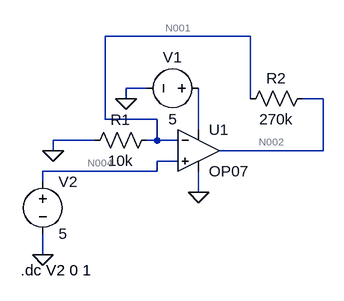
[diagram p0: schematic Draft1.asc]
Draft1.asc, the LTspice schematic file:
Version 4
SHEET 1 880 680
WIRE 256 -16 32 -16
WIRE 96 64 64 64
WIRE 64 80 64 64
WIRE 256 80 256 -16
WIRE 368 80 336 80
WIRE 32 112 32 -16
WIRE 112 112 32 112
WIRE 176 128 176 64
WIRE 16 144 -48 144
WIRE 112 144 112 112
WIRE 112 144 96 144
WIRE 144 144 112 144
WIRE -48 160 -48 144
WIRE 368 160 368 80
WIRE 368 160 208 160
WIRE 144 176 112 176
WIRE 112 192 112 176
WIRE 112 192 -64 192
WIRE -64 208 -64 192
WIRE 176 224 176 192
WIRE -64 320 -64 288
FLAG 64 80 0
FLAG -64 320 0
FLAG -48 160 0
FLAG 176 224 0
SYMBOL Opamps\\OP07 176 96 R0
SYMATTR InstName U1
SYMBOL voltage 192 64 R90
WINDOW 0 -32 56 VBottom 2
WINDOW 3 32 56 VTop 2
WINDOW 123 0 0 Left 0
WINDOW 39 0 0 Left 0
SYMATTR InstName V1
SYMATTR Value 5
SYMBOL voltage -64 192 R0
WINDOW 123 0 0 Left 0
WINDOW 39 0 0 Left 0
SYMATTR InstName V2
SYMATTR Value 5
SYMBOL res 112 128 R90
WINDOW 0 0 56 VBottom 2
WINDOW 3 32 56 VTop 2
SYMATTR InstName R1
SYMATTR Value 10k
SYMBOL res 352 64 R90
WINDOW 0 0 56 VBottom 2
WINDOW 3 32 56 VTop 2
SYMATTR InstName R2
SYMATTR Value 270k
TEXT -98 344 Left 2 !.dc V2 0 1

The netlist it stands for:
* Draft1.asc
XU1 N004 N001 N003 0 N002 LT1001  ; OP07, pins In+ In- V+ V- OUT
V1 N003 0 5
V2 N004 0 5
R1 N001 0 10k
R2 N002 N001 270k
.dc V2 0 1
.lib LTC.lib
.backanno
.end

* Results of the author's LTspice run, read from the files saved beside the schematic
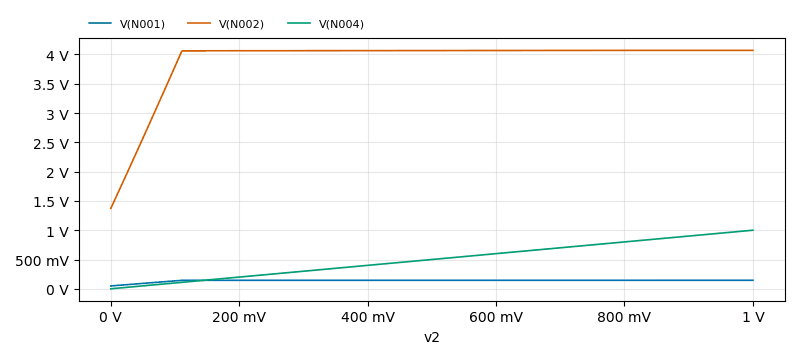
[diagram p1: DC transfer characteristic of Draft1.asc, plotted from the saved traces]
* DC transfer characteristic, 1 run:
*   V(N001): 49 mV at v2=0 V, 145.5 mV at v2=1 V, min 49 mV, max 145.5 mV
*   V(N002): 1.372 V at v2=0 V, 4.07 V at v2=1 V, min 1.372 V, max 4.07 V
*   V(N004): 0 V at v2=0 V, 1 V at v2=1 V, min 0 V, max 1 V